# EAGLE design main_pa4 (EAGLE 4.11)
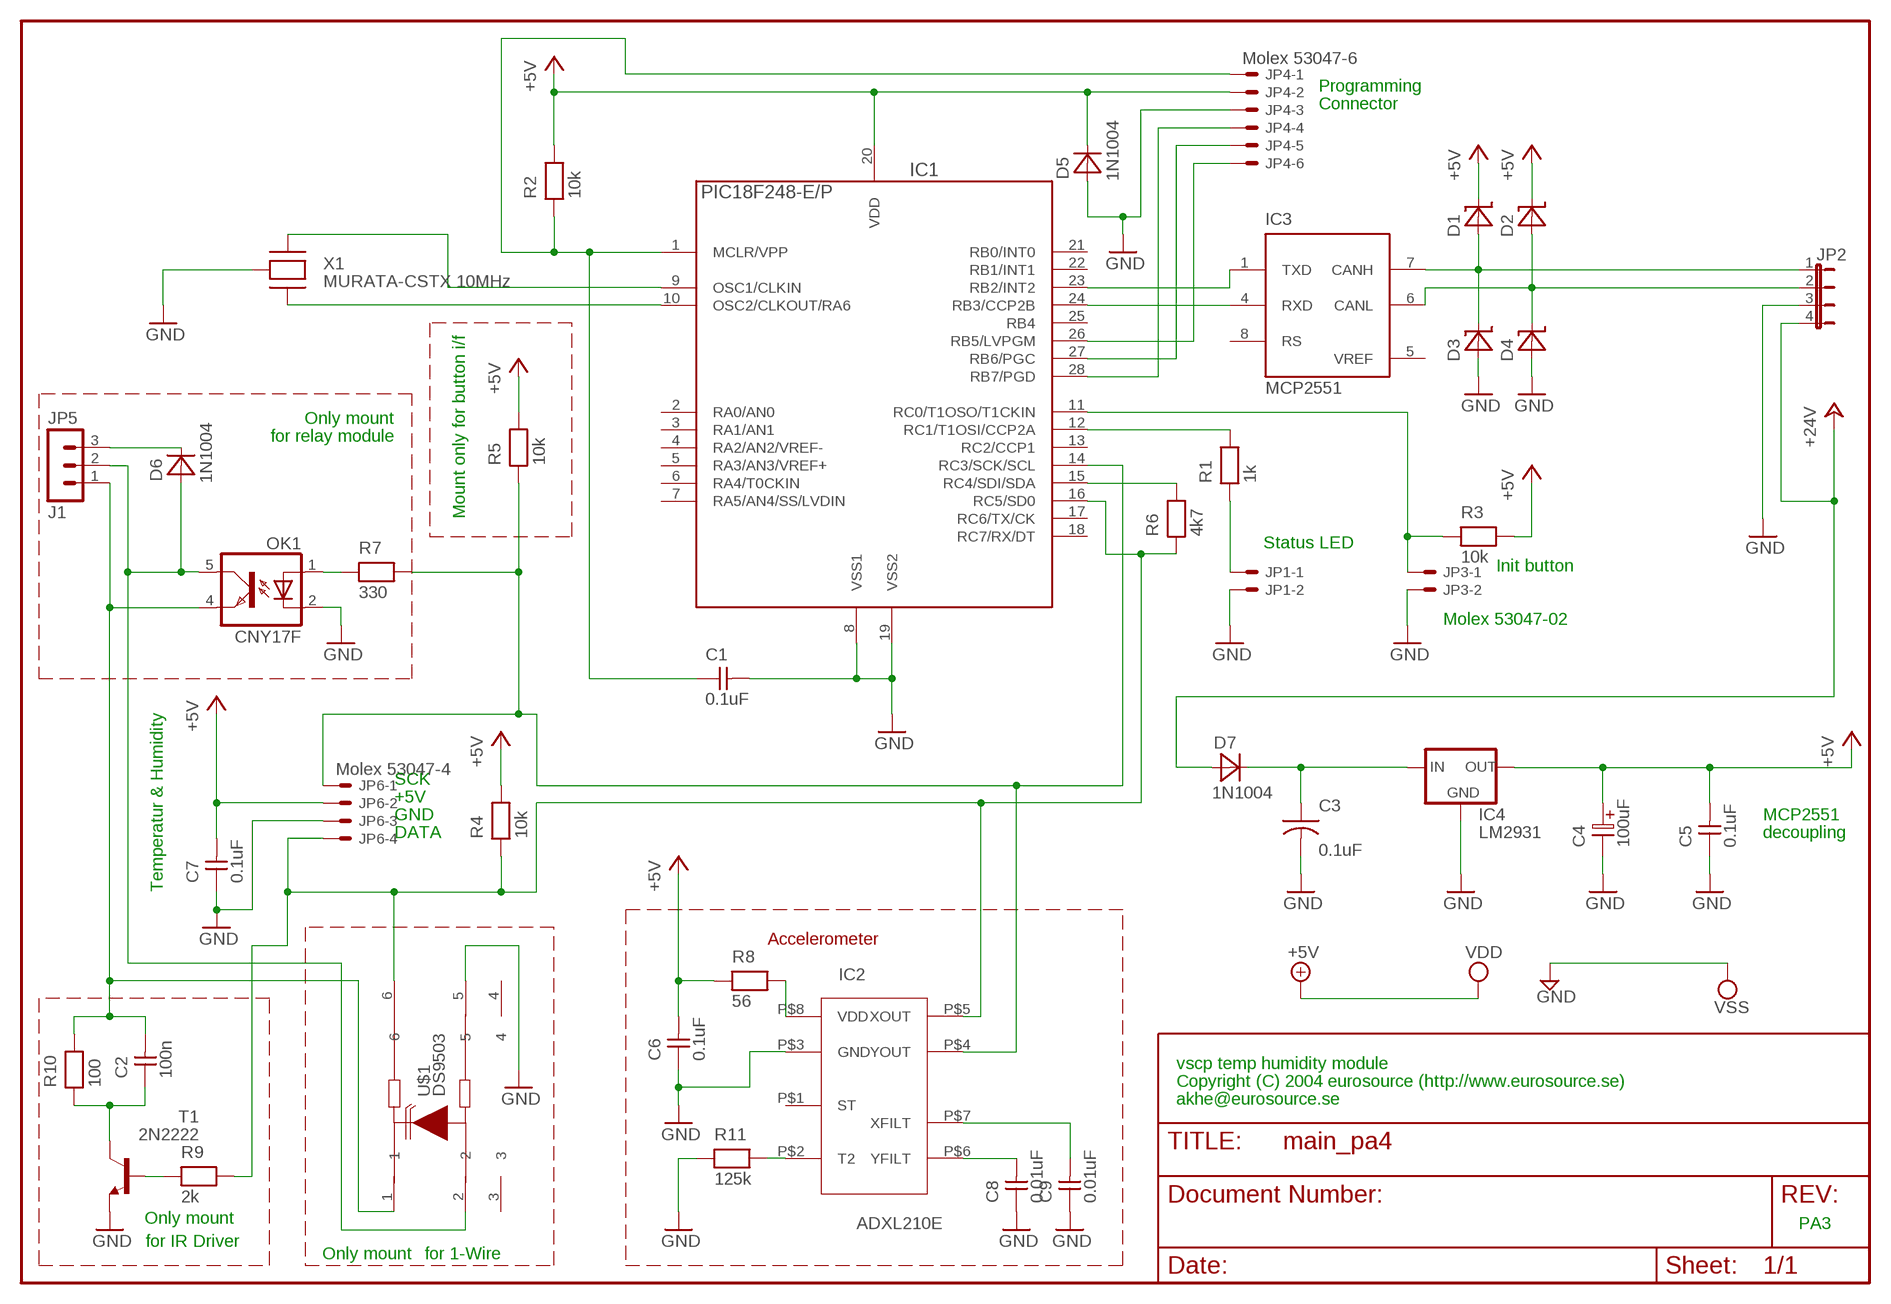
[diagram p0: schematic, sheet 1]

## Parts
C1  0.1uF  CAPNP-2,5  [C-2,5]
C2  100n  CAPNP-2,5  [C-2,5]
C3  0.1uF  CAP-5  [C-5]
C4  100uF  ELC-5  [ES-5]
C5  0.1uF  CAPNP-2,5  [C-2,5]
C6  0.1uF  CAPNP-2,5  [C-2,5]
C7  0.1uF  CAPNP-2,5  [C-2,5]
C8  0.01uF  CAPNP-2,5  [C-2,5]
C9  0.01uF  CAPNP-2,5  [C-2,5]
D1  ZDIO-2,5  [D-2,5]
D2  ZDIO-2,5  [D-2,5]
D3  ZDIO-2,5  [D-2,5]
D4  ZDIO-2,5  [D-2,5]
D5  1N1004  DIODE-7,5  [D-7,5]
D6  1N1004  DIODE-7,5  [D-7,5]
D7  1N1004  DIODE-7,5  [D-7,5]
IC1  PIC18F248-E/P  PIC18F252-E/P  [PDIP-28]
IC2  ADXL210E  [TSOC8]
IC3  MCP2551  MCP2551SN  [SO-08]
IC4  LM2931  78LXX  [78LXX]
JP1  53047-02  [53047-02]
JP2  JP4E  [JP4]
JP3  53047-02  [53047-02]
JP4  Molex 53047-6  53047-06  [53047-06]
JP5  J1  MA03-1  [MA03-1]
JP6  Molex 53047-4  53047-04  [53047-04]
OK1  CNY17F  [DIL06]
R1  1k  RESEU-5  [R-5]
R2  10k  RESEU-5  [R-5]
R3  10k  RESEU-5  [R-5]
R4  10k  RESEU-5  [R-5]
R5  10k  RESEU-5  [R-5]
R6  4k7  RESEU-5  [R-5]
R7  330  RESEU-5  [R-5]
R8  56  RESEU-5  [R-5]
R9  2k  RESEU-5  [R-5]
R10  100  RESEU-5  [R-5]
R11  125k  RESEU-5  [R-5]
T1  2N2222  [TO18]
U$1  DS9503  [TSOC6]
X1  MURATA-CSTX 10MHz  MURATA-CSTX  [RESONATOR-MURATA]

## Nets
5V': IC2.P$8(VDD) R8.2
+5V: D5.2(K) IC1.20(VDD) JP4.2 R2.2
+24V: D7.1(A) JP2.4
CANH: D1.1(A) D3.2(K) IC3.7(CANH) JP2.1
CANL: D2.1(A) D4.2(K) IC3.6(CANL) JP2.2
GND: C1.2 C3.2 C4.2 C5.1 C6.1 C7.1 C8.1 C9.1 D3.1(A) D4.1(A) D5.1(A) IC1.8(VSS1) IC1.9(OSC1/CLKIN) IC1.19(VSS2) IC2.P$3(GND) IC4.GND JP1.2 JP2.3 JP3.2 JP4.3 JP6.3 OK1.2(C) R11.1 T1.1(E) U$1.5 X1.1(XTIN) X1.2(GND) ; supply symbol labelled VSS
MCLR: C1.1 IC1.1(MCLR/VPP) JP4.1 R2.1
N$1: IC1.10(OSC2/CLKOUT/RA6) X1.3(XTOUT)
N$2: IC1.12(RC1/T1OSI/CCP2A) R1.2
N$5: JP1.1 R1.1
N$6: IC1.11(RC0/T1OSO/T1CKIN) JP3.1 R3.1
N$8: OK1.1(A) R7.1
N$9: D6.2(K) JP5.3
N$10: IC2.P$2(T2) R11.2
N$12: R9.1 T1.2(B)
N$13: C2.1 R10.1 T1.3(C)
N$22: C3.1 D7.2(K) IC4.IN
OWDATA: C2.2 JP5.1 OK1.4(EMIT) R10.2 U$1.1
OWGND: D6.1(A) JP5.2 OK1.5(COL) U$1.2
PGC: IC1.27(RB6/PGC) JP4.5
PGD: IC1.28(RB7/PGD) JP4.4
PGM: IC1.26(RB5/LVPGM) JP4.6
RXCAN: IC1.24(RB3/CCP2B) IC3.4(RXD)
SCK: IC1.14(RC3/SCK/SCL) IC2.P$4(YOUT) JP6.1 R5.1 R7.2
SDA: IC1.15(RC4/SDI/SDA) R6.2
SDO: IC1.16(RC5/SD0) IC2.P$5(XOUT) JP6.4 R4.1 R6.1 R9.2 U$1.6
TXCAN: IC1.23(RB2/INT2) IC3.1(TXD)
VDD: C4.1 C5.2 C6.2 C7.2 D1.2(K) D2.2(K) IC4.OUT JP6.2 R3.2 R4.2 R5.2 R8.1 ; supply symbol labelled +5V
XFILT: C9.2 IC2.P$7(XFILT)
YFILT: C8.2 IC2.P$6(YFILT)
Unconnected: IC1.2(RA0/AN0) IC1.3(RA1/AN1) IC1.4(RA2/AN2/VREF-) IC1.5(RA3/AN3/VREF+) IC1.6(RA4/T0CKIN) IC1.7(RA5/AN4/SS/LVDIN) IC1.13(RC2/CCP1) IC1.17(RC6/TX/CK) IC1.18(RC7/RX/DT) IC1.21(RB0/INT0) IC1.22(RB1/INT1) IC1.25(RB4) IC2.P$1(ST) IC3.8(RS) U$1.3 U$1.4

## Notes on the sheet
- Programming
- Connector
- Only mount
- for relay module
- Mount only for button i/f
- Status LED
- Init button
- Molex 53047-02
- SCK
- +5V
- GND | MCP2551
- DATA | decoupling
- Temperatur & Humidity
- Accelerometer
- vscp temp humidity module
- Copyright (C) 2004 eurosource (http://www.eurosource.se)
- akhe@eurosource.se
- Only mount
- PA3
- for IR Driver | Only mount | for 1-Wire

## Power pins joined to a net without a drawn wire
GND: IC3.2(VSS)
VDD: IC3.3(VDD)
VREF: IC3.5(VREF)

## Library data of the parts
C1 C2 C5-C9 = discrete:CAPNP-2,5
C3 = discrete:CAP-5
C4 = discrete:ELC-5
D1-D4 = discrete:ZDIO-2,5
D5-D7 = discrete:DIODE-7,5
IC1 = pic18:PIC18*F252-?: 18F252, 28 pin, 32Kb prog, 1536 data, 256 EEPROM
IC2 = eurosource_dallas:ADXL210E
IC3 = microchip_can:MCP2551: High Speed CAN tranceiver
IC4 = v-reg:78LXX: VOLTAGE REGULATOR
JP1 JP3 = con-molex:53?-02: CONNECTOR wire to board 1.25 mm (.049 inch) pitch header
JP2 = jumper:JP4E: JUMPER
JP4 = con-molex:53?-06: CONNECTOR wire to board 1.25 mm (.049 inch) pitch header
JP5 = con-lstb:MA03-1: PIN HEADER
JP6 = con-molex:53?-04: CONNECTOR wire to board 1.25 mm (.049 inch) pitch header
OK1 = optocoupler:CNY17F: SIEMENS OPTO COUPLER
R1-R11 = discrete:RESEU-5
T1 = transistor:2N2222: NPN TRANSISTOR
U$1 = eurosource_dallas:DS9503
X1 = eurosource_ftdi:MURATA-CSTX

## Board
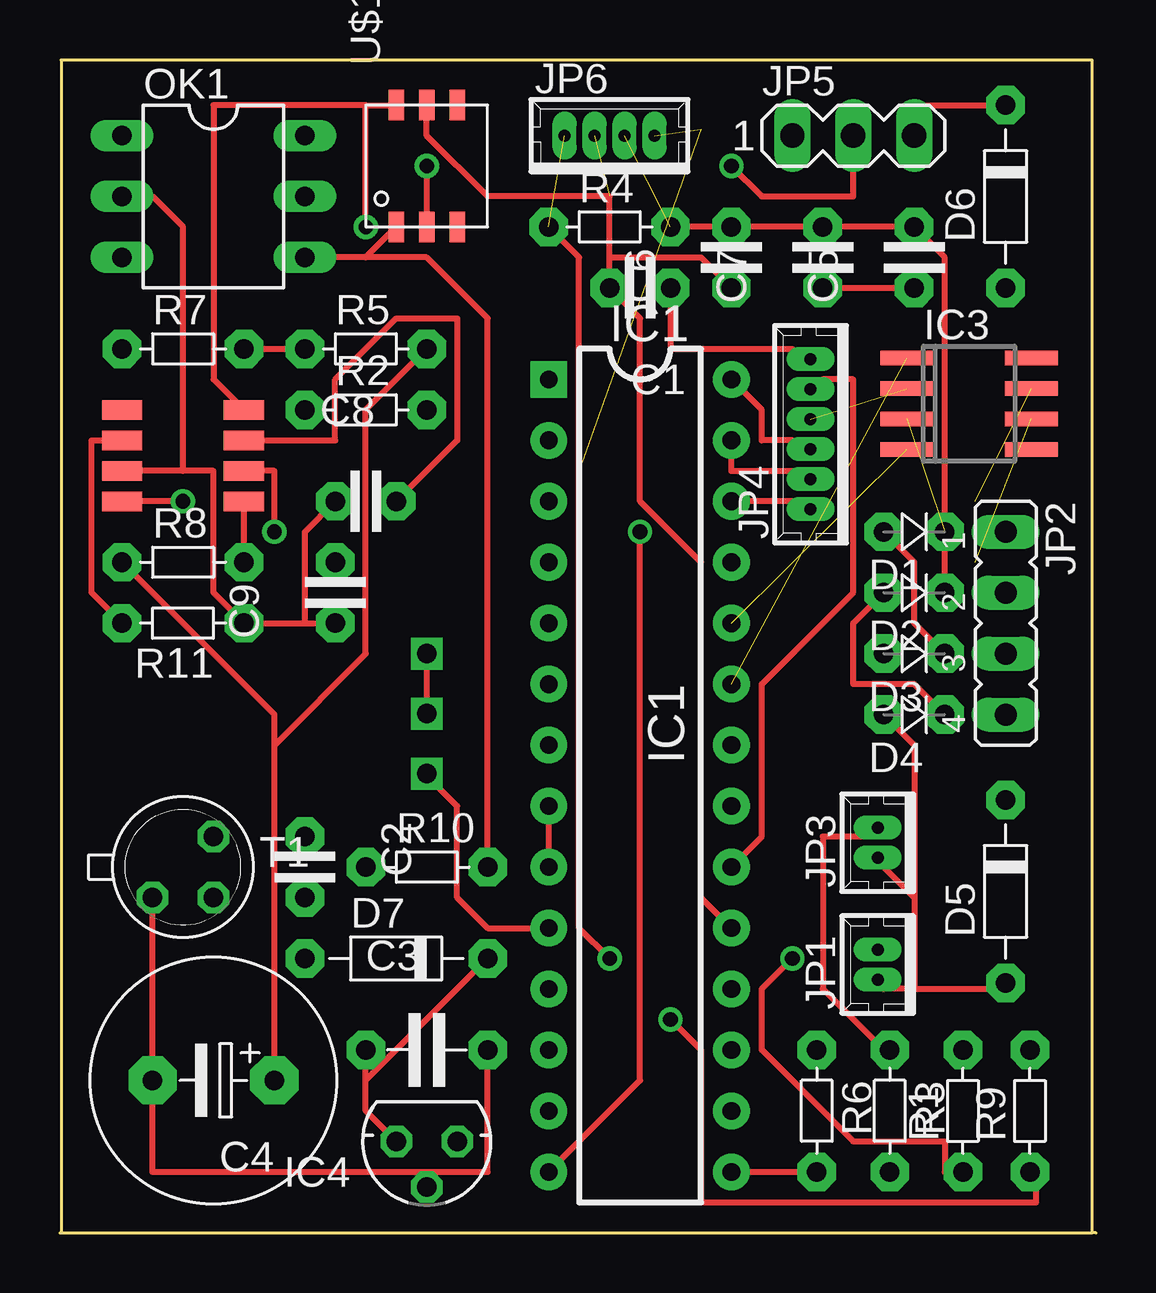
[diagram p1: board, top side]
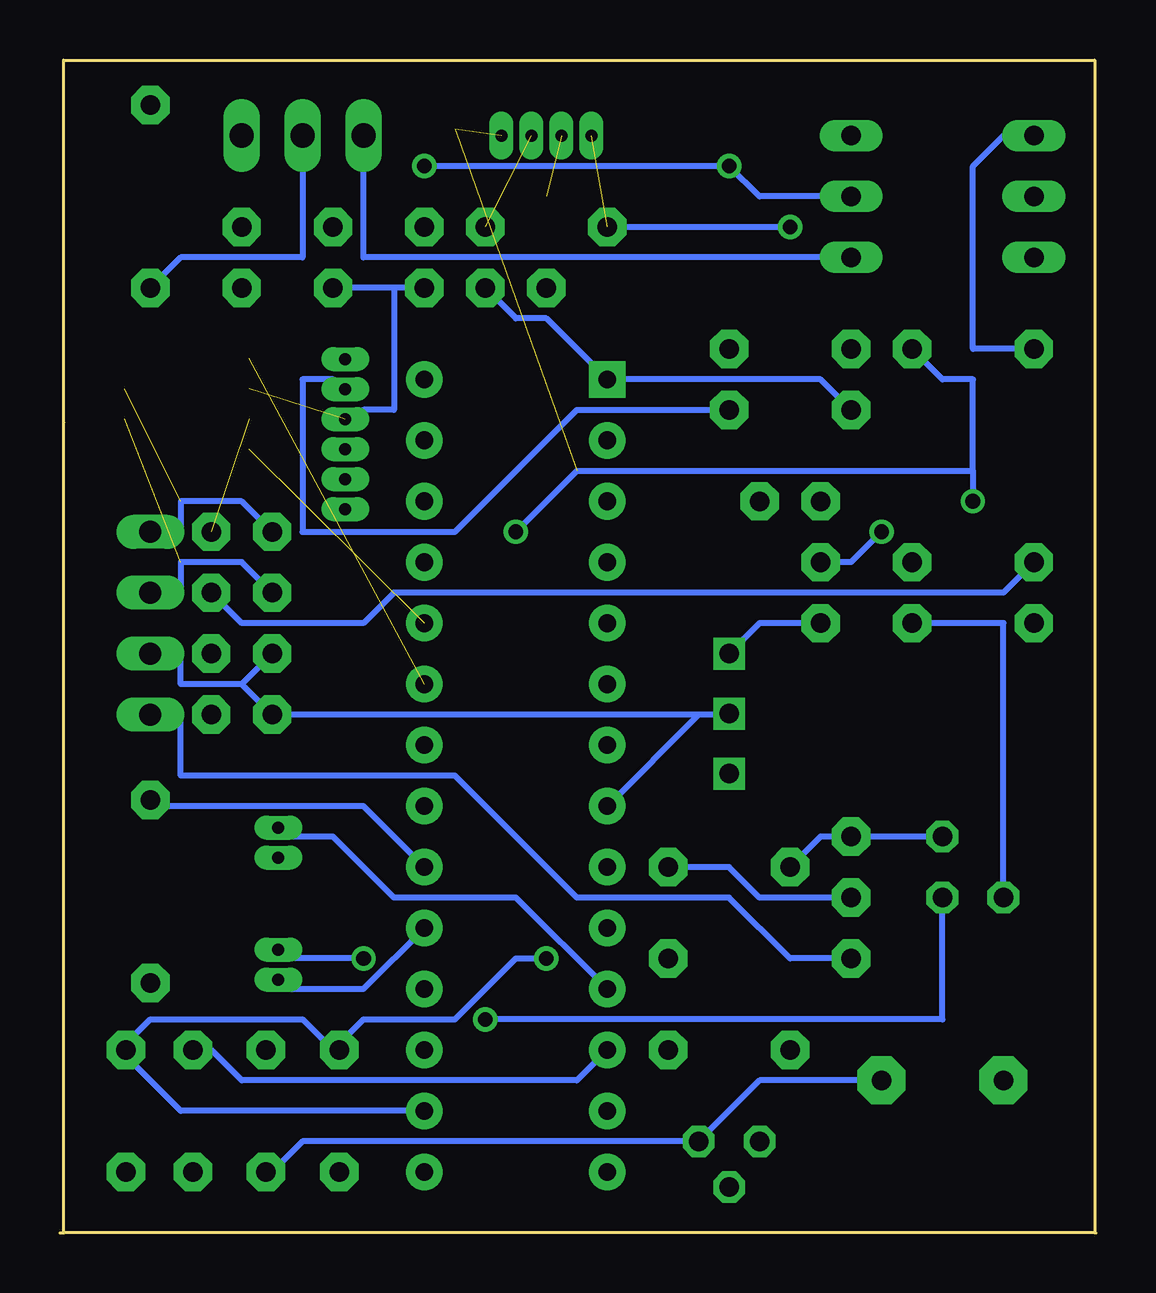
[diagram p2: board, bottom side, seen from below]

Size 43.18 x 48.87 mm. Coordinates in mm from the lower left corner, seen from the top.
Copper layers (1*16): Top 0.035mm / dielectric 1.5mm / Bottom 0.035mm
Design rules "default": minimum track width 10mil, minimum drill 24mil, track to track 8mil, track to pad 8mil, pad to pad 8mil, via to via 8mil, smd to smd 8mil, copper to edge 40mil, drill to drill 8mil, minimum pad ring 10mil, minimum via ring 8mil, stop-mask expansion 4mil, vias tented up to drill 0mil, thermal gap 10mil

### Footprints (pad centres in the part's own frame; a part is rotated, then mirrored left to right if it is on the bottom)
C-2,5 = drill 0.813 pad 1.6 octagon: 1 -1.27,0; 2 1.27,0
C-5 = drill 0.813 pad 1.6 octagon: 1 -2.54,0; 2 2.54,0
ES-5 = drill 0.813 pad 2.007 octagon: 1 -2.54,0; 2 2.54,0
D-2,5 = drill 0.813 pad 1.6 octagon: 1 -1.27,0; 2 1.27,0
D-7,5 = drill 0.813 pad 1.6 octagon: 1 -3.81,0; 2 3.81,0
PDIP-28 = drill 0.737 pad 1.524 square: 1 -17.78,-3.81 | drill 0.737 pad 1.524 round: 2 -15.24,-3.81; 3 -12.7,-3.81; 4 -10.16,-3.81; 5 -7.62,-3.81; 6 -5.08,-3.81; 7 -2.54,-3.81; 8 0,-3.81; 9 2.54,-3.81; 10 5.08,-3.81; 11 7.62,-3.81; 12 10.16,-3.81; 13 12.7,-3.81; 14 15.24,-3.81; 15 15.24,3.81; 16 12.7,3.81; 17 10.16,3.81; 18 7.62,3.81; 19 5.08,3.81; 20 2.54,3.81; 21 0,3.81; 22 -2.54,3.81; 23 -5.08,3.81; 24 -7.62,3.81; 25 -10.16,3.81; 26 -12.7,3.81; 27 -15.24,3.81; 28 -17.78,3.81
TSOC8 = smd 1.676 x 0.813: P$1 -2.54,1.27; P$2 -2.54,0; P$3 -2.54,-1.27; P$4 -2.54,-2.54; P$5 2.54,1.27; P$6 2.54,0; P$7 2.54,-1.27; P$8 2.54,-2.54
SO-08 = smd 0.6 x 2.2: 1 -1.905,-2.6; 2 -0.635,-2.6; 3 0.635,-2.6; 4 1.905,-2.6; 5 1.905,2.6; 6 0.635,2.6; 7 -0.635,2.6; 8 -1.905,2.6
78LXX = drill 0.813 octagon: GND 0,1.905; IN 1.27,0; OUT -1.27,0
53047-02 = drill 0.5 pad 0.698 long: 1 0.625,0; 2 -0.625,0
JP4 = drill 0.914 long: 1 -3.81,0; 2 -1.27,0; 3 1.27,0; 4 3.81,0
53047-06 = drill 0.5 pad 0.698 long: 1 3.125,0; 2 1.875,0; 3 0.625,0; 4 -0.625,0; 5 -1.875,0; 6 -3.125,0
MA03-1 = drill 1.016 long: 1 -2.54,0; 2 0,0; 3 2.54,0
53047-04 = drill 0.5 pad 0.698 long: 1 1.875,0; 2 0.625,0; 3 -0.625,0; 4 -1.875,0
DIL06 = drill 0.813 long: 1 -2.54,-3.81; 2 0,-3.81; 3 2.54,-3.81; 4 2.54,3.81; 5 0,3.81; 6 -2.54,3.81
R-5 = drill 0.813 pad 1.6 octagon: 1 -2.54,0; 2 2.54,0
TO18 = drill 0.813 octagon: 1 -1.27,-1.27; 2 1.27,-1.27; 3 1.27,1.27
TSOC6 = smd 1.27 x 0.635: 1 -2.54,1.27; 2 -2.54,0; 3 -2.54,-1.27; 4 2.54,-1.27; 5 2.54,0; 6 2.54,1.27
RESONATOR-MURATA = drill 0.813 square: 1 0,0; 2 2.5,0; 3 5,0

### Placement (x,y rotation side)
C1  24.18,39.37 180 top
C2  10.21,15.24 270 top
C3  15.29,7.62 0 top
C4  6.4,6.35 180 top
C5  35.61,40.64 90 top
C6  27.99,40.64 90 top
C7  31.8,40.64 90 top
C8  12.75,30.48 0 top
C9  11.48,26.67 90 top
D1  35.61,29.21 0 top
D2  35.61,26.67 0 top
D3  35.61,24.13 0 top
D4  35.61,21.59 0 top
D5  39.42,14.22 90 top
D6  39.42,43.18 90 top
D7  14.02,11.43 0 top
IC1  24.18,17.78 270 top
IC2  5.13,33.02 0 top
IC3  37.89,34.54 270 top
IC4  15.29,3.81 180 top
JP1  34.09,11.18 90 top
JP2  39.42,25.4 270 top
JP3  34.09,16.26 90 top
JP4  31.29,33.27 90 top
JP5  33.07,45.72 0 top
JP6  22.91,45.72 0 top
OK1  6.4,43.18 270 top
R1  37.64,5.08 90 top
R2  12.75,34.29 0 top
R3  34.59,5.08 270 top
R4  22.91,41.91 0 top
R5  12.75,36.83 0 top
R6  31.54,5.08 270 top
R7  5.13,36.83 0 top
R8  5.13,27.94 0 top
R9  40.44,5.08 90 top
R10  15.29,15.24 0 top
R11  5.13,25.4 180 top
T1  5.13,15.24 0 top
U$1  15.29,44.45 90 top
U$2  [DIN_SIMPLE]  0.05,0 0 top
X1  15.29,24.13 270 top

### Tracks (layer width: path | path; a pad name or v marks a point on that pad's centre or on a via)
5V'
  Top 0.254: R8.2 IC2.P$8
+5V
  Top 0.254: IC1.20 29.26,16.51 29.26,22.86 33.07,26.67 33.07,35.56 31.8,35.56 JP4.2
  Bottom 0.254: IC1.20 30.53,17.78 39.42,17.78 D5.2 | R2.2 21.64,34.29 26.72,29.21 33.07,29.21 33.07,35.56 31.8,35.56 JP4.2
+24V
  Bottom 0.254: D7.1 12.75,11.43 15.29,13.97 21.64,13.97 26.72,19.05 38.15,19.05 38.15,21.59 JP2.4
CANH  (1 unrouted)
  Top 0.254: D3.2 35.61,25.4 35.61,27.94 D1.1
  Bottom 0.254: D1.1 35.61,30.48 38.15,30.48 38.15,29.21 JP2.1
CANL  (1 unrouted)
  Top 0.254: D4.2 35.61,22.86 33.07,22.86 33.07,25.4 D2.1
  Bottom 0.254: D2.1 35.61,27.94 38.15,27.94 38.15,26.67 JP2.2
GND  (2 unrouted)
  Top 0.254: C7.1 C5.1 | U$1.5 15.29,45.72 17.83,43.18 22.91,43.18 22.91,40.64 | 22.91,40.64 C1.2 24.18,38.1 24.18,30.48 26.72,27.94 26.72,13.97 IC1.19 | C6.1 26.72,40.64 22.91,40.64 | 15.29,2.54 17.83,2.54 C3.2 | T1.1 C4.2 3.86,2.54 15.29,2.54 | 15.29,2.54 IC4.GND | 35.61,10.16 39.42,10.16 D5.1 | 35.61,10.16 34.34,10.16 JP1.2 | 35.61,13.97 34.34,15.24 JP3.2 | 35.61,13.97 35.61,10.16 | D4.1 35.61,20.32 35.61,13.97 | IC1.8 IC1.9 | X1.1 X1.2 15.29,21.59 | 5.13,31.75 6.4,31.75 6.4,26.67 R11.1 10.21,25.4 | 5.13,31.75 IC2.P$3 | 5.13,31.75 5.13,41.91 3.86,43.18 OK1.2 | 10.21,25.4 C9.1 | C8.1 10.21,29.21 10.21,25.4
  Bottom 0.254: 29.26,39.37 29.26,34.29 30.53,34.29 JP4.3 | C6.1 29.26,39.37 | 29.26,39.37 C7.1 | 35.61,22.86 38.15,22.86 38.15,24.13 JP2.3 | 35.61,22.86 D3.1 | 35.61,22.86 D4.1 16.56,21.59 | IC1.19 30.53,10.16 34.34,10.16 JP1.2 | X1.1 14.02,25.4 C9.1 | 16.56,21.59 IC1.8 | 16.56,21.59 15.29,21.59 X1.2 | T1.1 3.86,25.4 R11.1
MCLR
  Top 0.254: C1.1 25.45,36.83 30.53,36.83 JP4.1
  Bottom 0.254: C1.1 24.18,38.1 22.91,38.1 IC1.1 11.48,35.56 R2.1
N$1
  Top 0.254: IC1.10 17.83,12.7 16.56,13.97 16.56,17.78 15.29,19.05 X1.3
N$2
  Bottom 0.254: IC1.12 21.64,6.35 35.61,6.35 36.88,7.62 R1.2
N$5  (via drill 0.61)
  Top 0.254: v30.53,11.43 29.26,10.16 29.26,7.62 33.07,3.81 36.88,3.81 36.88,2.54 R1.1
  Bottom 0.254: v30.53,11.43 34.34,11.43 JP1.1
N$6
  Top 0.254: JP3.1 34.34,16.51 31.8,16.51 31.8,10.16 34.34,7.62 R3.1
  Bottom 0.254: IC1.11 24.18,13.97 29.26,13.97 31.8,16.51 34.34,16.51 JP3.1
N$8
  Bottom 0.254: R7.1 5.13,36.83 5.13,44.45 3.86,45.72 OK1.1
N$9
  Top 0.254: D6.2 35.61,46.99 JP5.3
N$10
  Top 0.254: IC2.P$2 1.32,33.02 1.32,26.67 R11.2
N$12  (via drill 0.61)
  Top 0.254: v25.45,8.89 26.72,7.62 26.72,1.27 40.69,1.27 40.69,2.54 R9.1
  Bottom 0.254: T1.2 6.4,8.89 v25.45,8.89
N$13
  Bottom 0.254: T1.3 C2.1 11.48,16.51 R10.1
N$22
  Top 0.254: IC4.IN 12.75,5.08 12.75,6.35 | 12.75,6.35 C3.1 | 12.75,6.35 D7.2
OWDATA
  Top 0.254: 12.75,40.64 U$1.1 | 12.75,40.64 OK1.4 | R10.2 17.83,38.1 15.29,40.64 12.75,40.64
  Bottom 0.254: C2.2 14.02,13.97 15.29,15.24 R10.2 | JP5.1 30.53,40.64 OK1.4
OWGND  (via drill 0.61)
  Top 0.254: v15.29,44.45 U$1.2 | v27.99,44.45 29.26,43.18 33.07,43.18 JP5.2
  Bottom 0.254: OK1.5 14.02,43.18 v15.29,44.45 v27.99,44.45 | D6.1 38.15,40.64 33.07,40.64 JP5.2
PGC
  Top 0.254: IC1.27 27.99,31.75 30.53,31.75 JP4.5
PGD
  Top 0.254: IC1.28 29.26,34.29 29.26,33.02 30.53,33.02 JP4.4
PGM
  Top 0.254: IC1.26 30.53,30.48 JP4.6
RXCAN  (1 unrouted)
SCK  (via drill 0.61)  (2 unrouted)
  Top 0.254: v5.13,30.48 IC2.P$4 | IC1.14 24.18,6.35 v24.18,29.21 | R7.2 R5.1
  Bottom 0.254: 5.13,31.75 5.13,35.56 6.4,35.56 R7.2 | 5.13,31.75 v5.13,30.48 | v24.18,29.21 21.64,31.75 5.13,31.75
SDA
  Top 0.254: IC1.15 R6.2 31.8,2.54
SDO  (via drill 0.61)  (1 unrouted)
  Top 0.254: 12.75,46.99 6.4,46.99 6.4,35.56 IC2.P$5 | 12.75,46.99 U$1.6 | v12.75,41.91 12.75,46.99 | v22.91,11.43 21.64,12.7 21.64,40.64 R4.1
  Bottom 0.254: IC1.16 38.15,5.08 40.69,7.62 | 31.8,7.62 33.07,8.89 39.42,8.89 40.69,7.62 | 40.69,7.62 R9.2 | R4.1 v12.75,41.91 | 31.8,7.62 30.53,8.89 26.72,8.89 24.18,11.43 v22.91,11.43 | 31.8,7.62 R6.1
TXCAN  (1 unrouted)
VDD  (2 unrouted)
  Top 0.254: D2.2 D1.2 36.88,40.64 C5.2 C7.2 C6.2 R4.2 | R8.1 8.94,21.59 8.94,20.32 | C4.1 8.94,20.32 | R5.2 12.75,34.29 12.75,24.13 8.94,20.32
  Bottom 0.254: C4.1 14.02,6.35 IC4.OUT 33.07,3.81 34.34,2.54 R3.2 | D2.2 35.61,25.4 30.53,25.4 29.26,26.67 3.86,26.67 R8.1
XFILT  (via drill 0.61)
  Top 0.254: IC2.P$7 8.94,31.75 v8.94,29.21
  Bottom 0.254: v8.94,29.21 10.21,27.94 C9.2
YFILT
  Top 0.254: IC2.P$6 11.48,33.02 11.48,35.56 14.02,38.1 16.56,38.1 16.56,33.02 C8.2